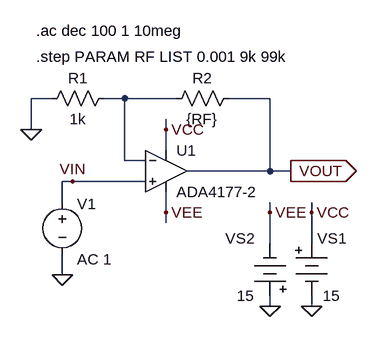
[diagram p0: schematic fig-01-04-01.asc]
fig-01-04-01.asc, the LTspice schematic file:
Version 4
SHEET 1 880 680
WIRE 32 64 0 64
WIRE 144 64 112 64
WIRE 224 64 144 64
WIRE 368 64 304 64
WIRE 0 112 0 64
WIRE 208 112 208 96
WIRE 208 144 208 112
WIRE 144 160 144 64
WIRE 176 160 144 160
WIRE 368 176 368 64
WIRE 368 176 240 176
WIRE 400 176 368 176
WIRE 64 192 48 192
WIRE 176 192 64 192
WIRE 48 224 48 192
WIRE 208 240 208 208
WIRE 368 240 368 224
WIRE 432 240 432 224
WIRE 208 256 208 240
WIRE 368 288 368 240
WIRE 432 288 432 240
WIRE 48 336 48 304
WIRE 368 384 368 368
WIRE 432 384 432 368
FLAG 0 112 0
FLAG 48 336 0
FLAG 400 176 VOUT
IOPIN 400 176 Out
FLAG 64 192 VIN
FLAG 368 384 0
FLAG 432 384 0
FLAG 368 240 VEE
FLAG 432 240 VCC
FLAG 208 112 VCC
FLAG 208 240 VEE
SYMBOL res 128 48 R90
WINDOW 0 0 56 VBottom 2
WINDOW 3 32 56 VTop 2
SYMATTR InstName R1
SYMATTR Value 1k
SYMBOL res 320 48 R90
WINDOW 0 0 56 VBottom 2
WINDOW 3 32 56 VTop 2
SYMATTR InstName R2
SYMATTR Value {RF}
SYMBOL voltage 48 208 R0
WINDOW 0 23 19 Left 2
WINDOW 3 -48 163 Left 2
WINDOW 123 23 104 Left 2
WINDOW 39 0 0 Left 0
SYMATTR InstName V1
SYMATTR Value ""
SYMATTR Value2 AC 1
SYMBOL Misc\\battery 432 272 R0
WINDOW 0 9 8 Left 2
WINDOW 3 17 96 Left 2
SYMATTR InstName VS1
SYMATTR Value 15
SYMBOL Misc\\battery 368 384 R180
WINDOW 0 24 104 Left 2
WINDOW 3 24 16 Left 2
SYMATTR InstName VS2
SYMATTR Value 15
SYMBOL Opamps\\ADA4177-2 208 176 R0
SYMATTR InstName U1
TEXT 8 -40 Left 2 !.ac dec 100 1 10meg
TEXT 8 0 Left 2 !.step PARAM RF LIST 0.001 9k 99k

The netlist it stands for:
* fig-01-04-01.asc
R1 N001 0 1k
R2 VOUT N001 {RF}
V1 VIN 0 AC 1
VS1 VCC 0 15
VS2 0 VEE 15
* U1: ADA4177-2 (symbol Opamps\ADA4177-2 not available, pins judged from their places): In+=VIN In-=N001 V+=VCC V-=VEE OUT=VOUT
.ac dec 100 1 10meg
.step PARAM RF LIST 0.001 9k 99k
.backanno
.end